# EAGLE design full_Bridge_v2 (EAGLE 9.6.2)
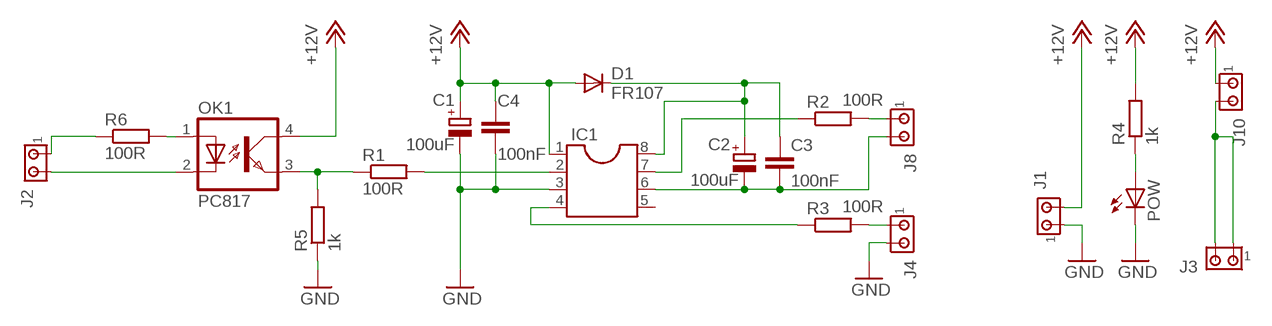
[diagram p0: schematic, sheet 1]

## Parts
C1  100uF  CPOL-EUE2,5-6E  [E2,5-6E]
C2  100uF  CPOL-EUE2.5-7  [E2,5-7]
C3  100nF  C-EU050-024X044  [C050-024X044]
C4  100nF  C-EU050-024X044  [C050-024X044]
D1  FR107  1N4004  [DO41-10]
IC1  DIL8  [DIL08]
J1  MTA02-100  [10X02MTA]
J2  MTA02-100  [10X02MTA]
J3  MTA02-100  [10X02MTA]
J4  MTA02-100  [10X02MTA]
J8  MTA02-100  [10X02MTA]
J10  MTA02-100  [10X02MTA]
OK1  PC817  [DIL04]
POW  LED3MM  [LED3MM]
R1  100R  R-EU_0204/7  [0204/7]
R2  100R  R-EU_0204/7  [0204/7]
R3  100R  R-EU_0207/12  [0207/12]
R4  1k  R-EU_0204/7  [0204/7]
R5  1k  R-EU_0204/7  [0204/7]
R6  100R  R-EU_0204/7  [0204/7]

## Nets
+12V: C1.+ C4.1 D1.A IC1.1 J1.2 J10.1 OK1.4(COL) R4.2
GND: C1.- C4.2 IC1.3 J1.1 J4.2 POW.K(C) R5.1
N$1: POW.A R4.1
N$2: J3.1 J3.2 J10.2
N$3: OK1.3(EMIT) R1.1 R5.2
N$4: C2.- C3.2 IC1.6 J8.2
N$5: C2.+ C3.1 D1.C IC1.8
N$6: J2.2 OK1.2(C)
N$7: IC1.7 R2.1
N$8: IC1.4 R3.1
N$9: IC1.2 R1.2
N$10: OK1.1(A) R6.2
N$11: J8.1 R2.2
N$12: J4.1 R3.2
N$13: J2.1 R6.1
Unconnected: IC1.5

## Library data of the parts
C1 C2 = rcl:CPOL-EU: POLARIZED CAPACITOR, European symbol
C3 C4 = rcl:C-EU: CAPACITOR, European symbol
D1 = adafruit:1N4004: DIODE General purpose 1N400x type rectifier (With bigger pads) http://www.ladyada.net/library/pcb/eaglelibrary.html
IC1 = ic-package:DIL8: Dual In Line / Socket
J1-J4 J8 J10 = con-amp:MTA02-100: AMP connector
OK1 = optocoupler:PC817: SHARP OPTO COUPLER; MPN: PC817X4J000F; OC_FARNELL: 9707727; OC_NEWARK: 97K7059
POW = adafruit:LED: LED OSRAM: - CHIPLED LG R971, LG N971, LY N971, LG Q971, LY Q971, LO R971, LY R971 LH N974, LH R974 LS Q976, LO Q976, LY Q976 LO Q996 - Hyper CHIPLED LW Q18S LB Q993, LB Q99A, LB R99A - SideLED LS A670, LO A670, LY A670, LG A670, LP A670 LB A673, LV A673, LT A673, LW A673 LH A674 LY A675 LS A676, LA A676, LO A676, LY A676, LW A676 LS A679, LY A679, LG A679 - Hyper Micro SIDELED® LS Y876, LA Y876, LO Y876, LY Y876 LT Y87S - SmartLED LW L88C, LW L88S LB L89C, LB L89S, LG L890 LS L89K, LO L89K, LY L89K LS L896, LA L896, LO L896, LY L896 - TOPLED LS T670, LO T670, LY T670, LG T670, LP T670 LSG T670, LSP T670, LSY T670, LOP T670, LYG T670 LG T671, LOG T671, LSG T671 LB T673, LV T673, LT T673, LW T673 LH T674 LS T676, LA T676, LO T676, LY T676, LB T676, LH T676, LSB T676, LW T676 LB T67C, LV T67C, LT T67C, LS T67K, LO T67K, LY T67K, LW E67C LS E67B, LA E67B, LO E67B, LY E67B, LB E67C, LV E67C, LT E67C LW T67C LS T679, LY T679, LG T679 LS T770, LO T770, LY T770, LG T770, LP T770 LB T773, LV T773, LT T773, LW T773 LH T774 LS E675, LA E675, LY E675, LS T675 LS T776, LA T776, LO T776, LY T776, LB T776 LHGB T686 LT T68C, LB T68C - Hyper Mini TOPLED® LB M676 - Mini TOPLED Santana® LG M470 LS M47K, LO M47K, LY M47K Source: http://www.osram.convergy.de/
R1-R6 = resistor:R-EU_: RESISTOR, European symbol

## Board
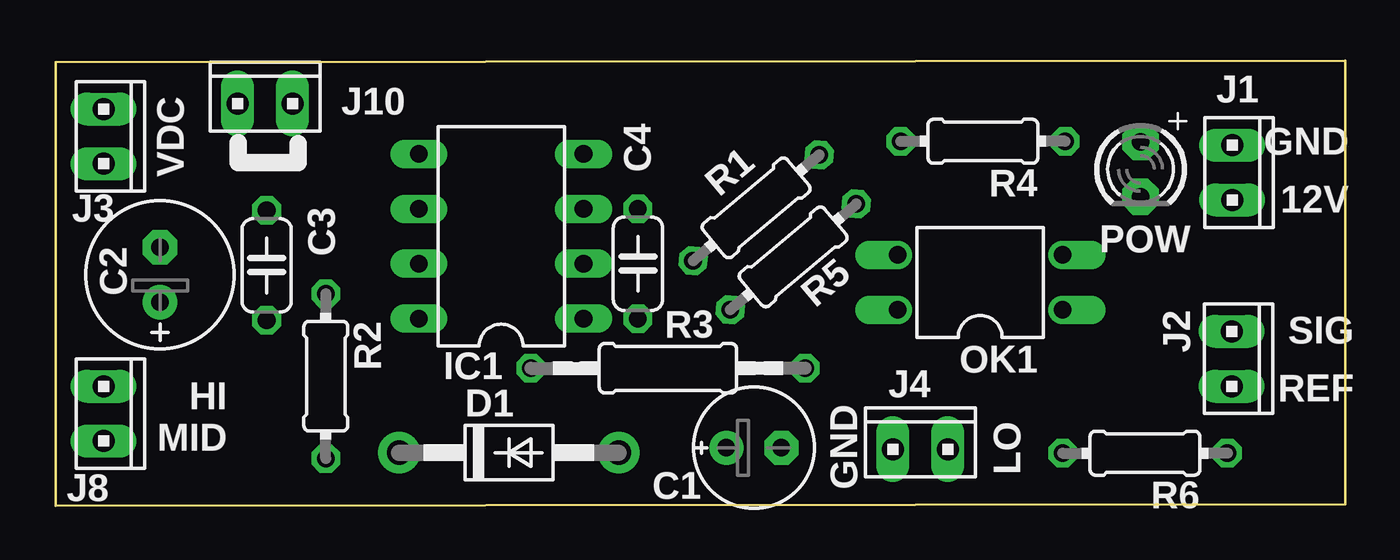
[diagram p1: board, top side]
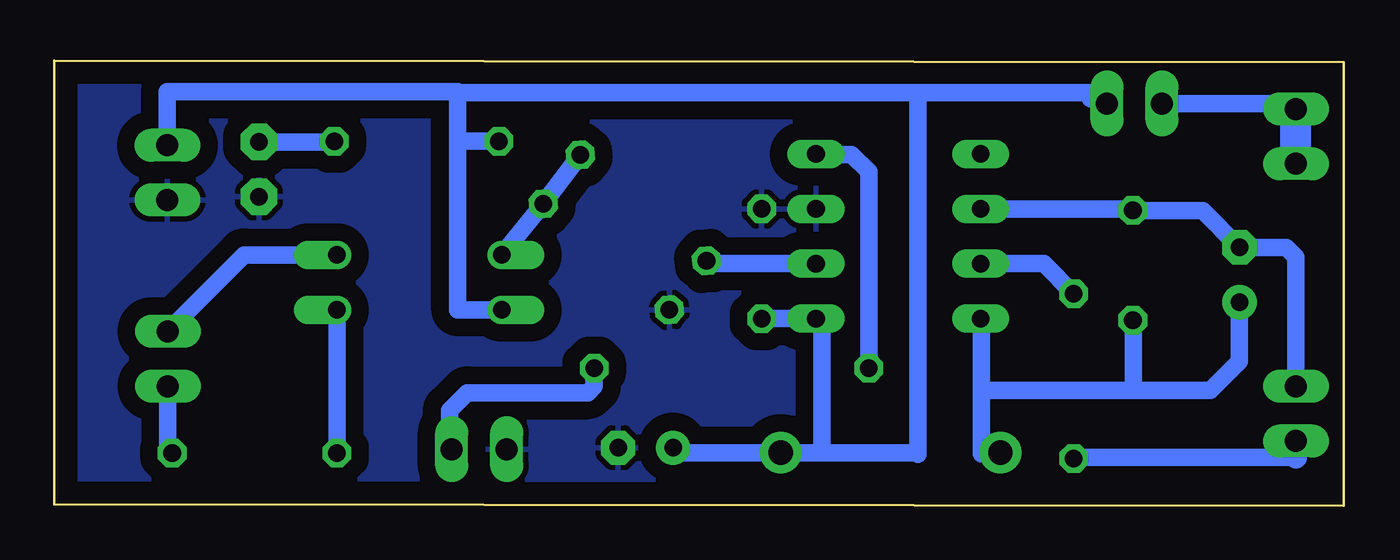
[diagram p2: board, bottom side, seen from below]

Size 59.64 x 20.6 mm. Coordinates in mm from the lower left corner, seen from the top.
Outline: 0,0 0,20.52 59.64,20.6 59.64,0.08 0,0
Copper layers (1*16): Top 0.035mm / dielectric 1.5mm / Bottom 0.035mm
Design rules "default *": minimum track width 10mil, minimum drill 24mil, track to track 8mil, track to pad 8mil, pad to pad 8mil, via to via 8mil, smd to smd 8mil, copper to edge 40mil, drill to drill 8mil, minimum pad ring 10mil, minimum via ring 8mil, stop-mask expansion 4mil, vias tented up to drill 0mil, thermal gap 10mil

### Footprints (pad centres in the part's own frame; a part is rotated, then mirrored left to right if it is on the bottom)
E2,5-6E = drill 0.813 pad 1.575: + -1.27,0 | drill 0.813 pad 1.575 octagon: - 1.27,0
E2,5-7 = drill 0.813 pad 1.6: + -1.27,0 | drill 0.813 pad 1.6 octagon: - 1.27,0
C050-024X044 = drill 0.813 octagon: 1 -2.54,0; 2 2.54,0
DO41-10 = drill 1.118 pad 1.93: A 5.08,0; C -5.08,0
DIL08 = drill 0.813 long: 1 -3.81,-3.81; 2 -1.27,-3.81; 3 1.27,-3.81; 4 3.81,-3.81; 5 3.81,3.81; 6 1.27,3.81; 7 -1.27,3.81; 8 -3.81,3.81
10X02MTA = drill 1.016 long: 1 1.27,0; 2 -1.27,0
DIL04 = drill 0.813 offset: 1 -1.27,-3.81; 2 1.27,-3.81; 3 1.27,3.81; 4 -1.27,3.81
LED3MM = drill 0.813 pad 1.676 octagon: A -1.27,0; K 1.27,0
0204/7 = drill 0.813 octagon: 1 -3.81,0; 2 3.81,0
0207/12 = drill 0.813 octagon: 1 -6.35,0; 2 6.35,0

### Placement (x,y rotation side)
C1  32.28,2.69 0 top
C2  4.83,10.69 90 top
C3  9.75,11.13 90 top
C4  26.92,11.2 90 top
D1  20.95,2.46 0 top
IC1  20.6,12.47 90 top
J1  54.41,15.42 270 top
J2  54.38,6.81 270 top
J3  2.21,17.09 270 top
J4  39.98,2.62 0 top
J8  2.21,4.27 270 top
J10  9.68,18.62 0 top
OK1  42.75,10.34 90 top
POW  50.16,15.57 270 top
R1  32.39,13.79 220 top
R2  12.49,6 270 top
R3  28.31,6.37 0 top
R4  42.88,16.87 180 top
R5  34.1,11.52 40 top
R6  50.37,2.44 180 top

### Tracks (layer width: path | path; a pad name or v marks a point on that pad's centre or on a via)
+12V
  Bottom 0.813: 11.71,18.85 J10.1 11.46,19.13 19.68,19.13 | 24.23,2.46 24.13,2.57 24.13,8.38 IC1.1 C4.1 | 24.23,2.46 D1.A 30.78,2.46 C1.+ | 19.68,19.13 19.68,2.39 19.76,2.46 24.23,2.46 | J1.2 54.41,19.15 40.97,19.15 40.97,19.13 | 40.97,19.13 19.68,19.13 | OK1.4 40.97,9.07 40.97,16.84 | 40.97,16.84 40.97,19.13 | R4.2 40.94,16.87 arc-90 40.97,16.84
GND
  pour Bottom (isolate 0.813): 0.53,0.1 0.53,20.57 59.61,20.6 59.61,0.13
N$1
  Bottom 0.813: POW.A 46.71,16.84 arc-90 R4.1
N$2
  Bottom 0.813: J10.2 2.46,18.62 J3.2
  Bottom 1.422: 2.06,18.34 J3.2 J3.1
N$3
  Bottom 0.813: 38.86,11.51 arc90 38.94,11.58 OK1.3 R5.2 R1.1
N$4
  Bottom 0.813: IC1.6 9.83,13.74 C3.2 6.53,13.67 C2.- 2.67,11.96 2.21,11.51 J8.2
N$5
  Bottom 0.813: C3.1 9.73,8.56 9.73,5.36 9.75,5.33 | IC1.8 16.76,8.64 16.76,5.28 | 16.76,5.28 16.76,2.41 16.71,2.46 D1.C | C2.+ 4.83,6.68 6.17,5.33 9.75,5.33 | 9.75,5.33 16.71,5.33 16.76,5.28
N$6
  Bottom 0.813: J2.2 50.85,11.61 OK1.2
N$7
  Bottom 0.813: IC1.7 13.88,11.2 R2.1
N$8
  Bottom 0.813: R3.1 21.96,15.46 22.76,16.26 24.38,16.26 IC1.4
N$9
  Bottom 0.813: R1.2 29.33,11.2 IC1.2
N$10
  Bottom 0.813: R6.2 OK1.1
N$11
  Bottom 0.813: R2.2 11.85,2.24 2.21,2.24
  Bottom 1.016: 2.21,2.24 J8.1
N$12
  Bottom 0.813: J4.1 41.25,2.74 41.35,2.85 41.35,4.42 40.54,5.23 34.95,5.23 34.66,5.52 R3.2
N$13
  Bottom 0.813: J2.1 54.38,2.64 arc-90 R6.1

### Text on the board
tNames: GND / 12V | VDC | SIG / REF | HI / MID | GND | LO